# Altium schematic sheet Power.SchDoc
size C; SheetNumber: 4; SheetTotal: 5
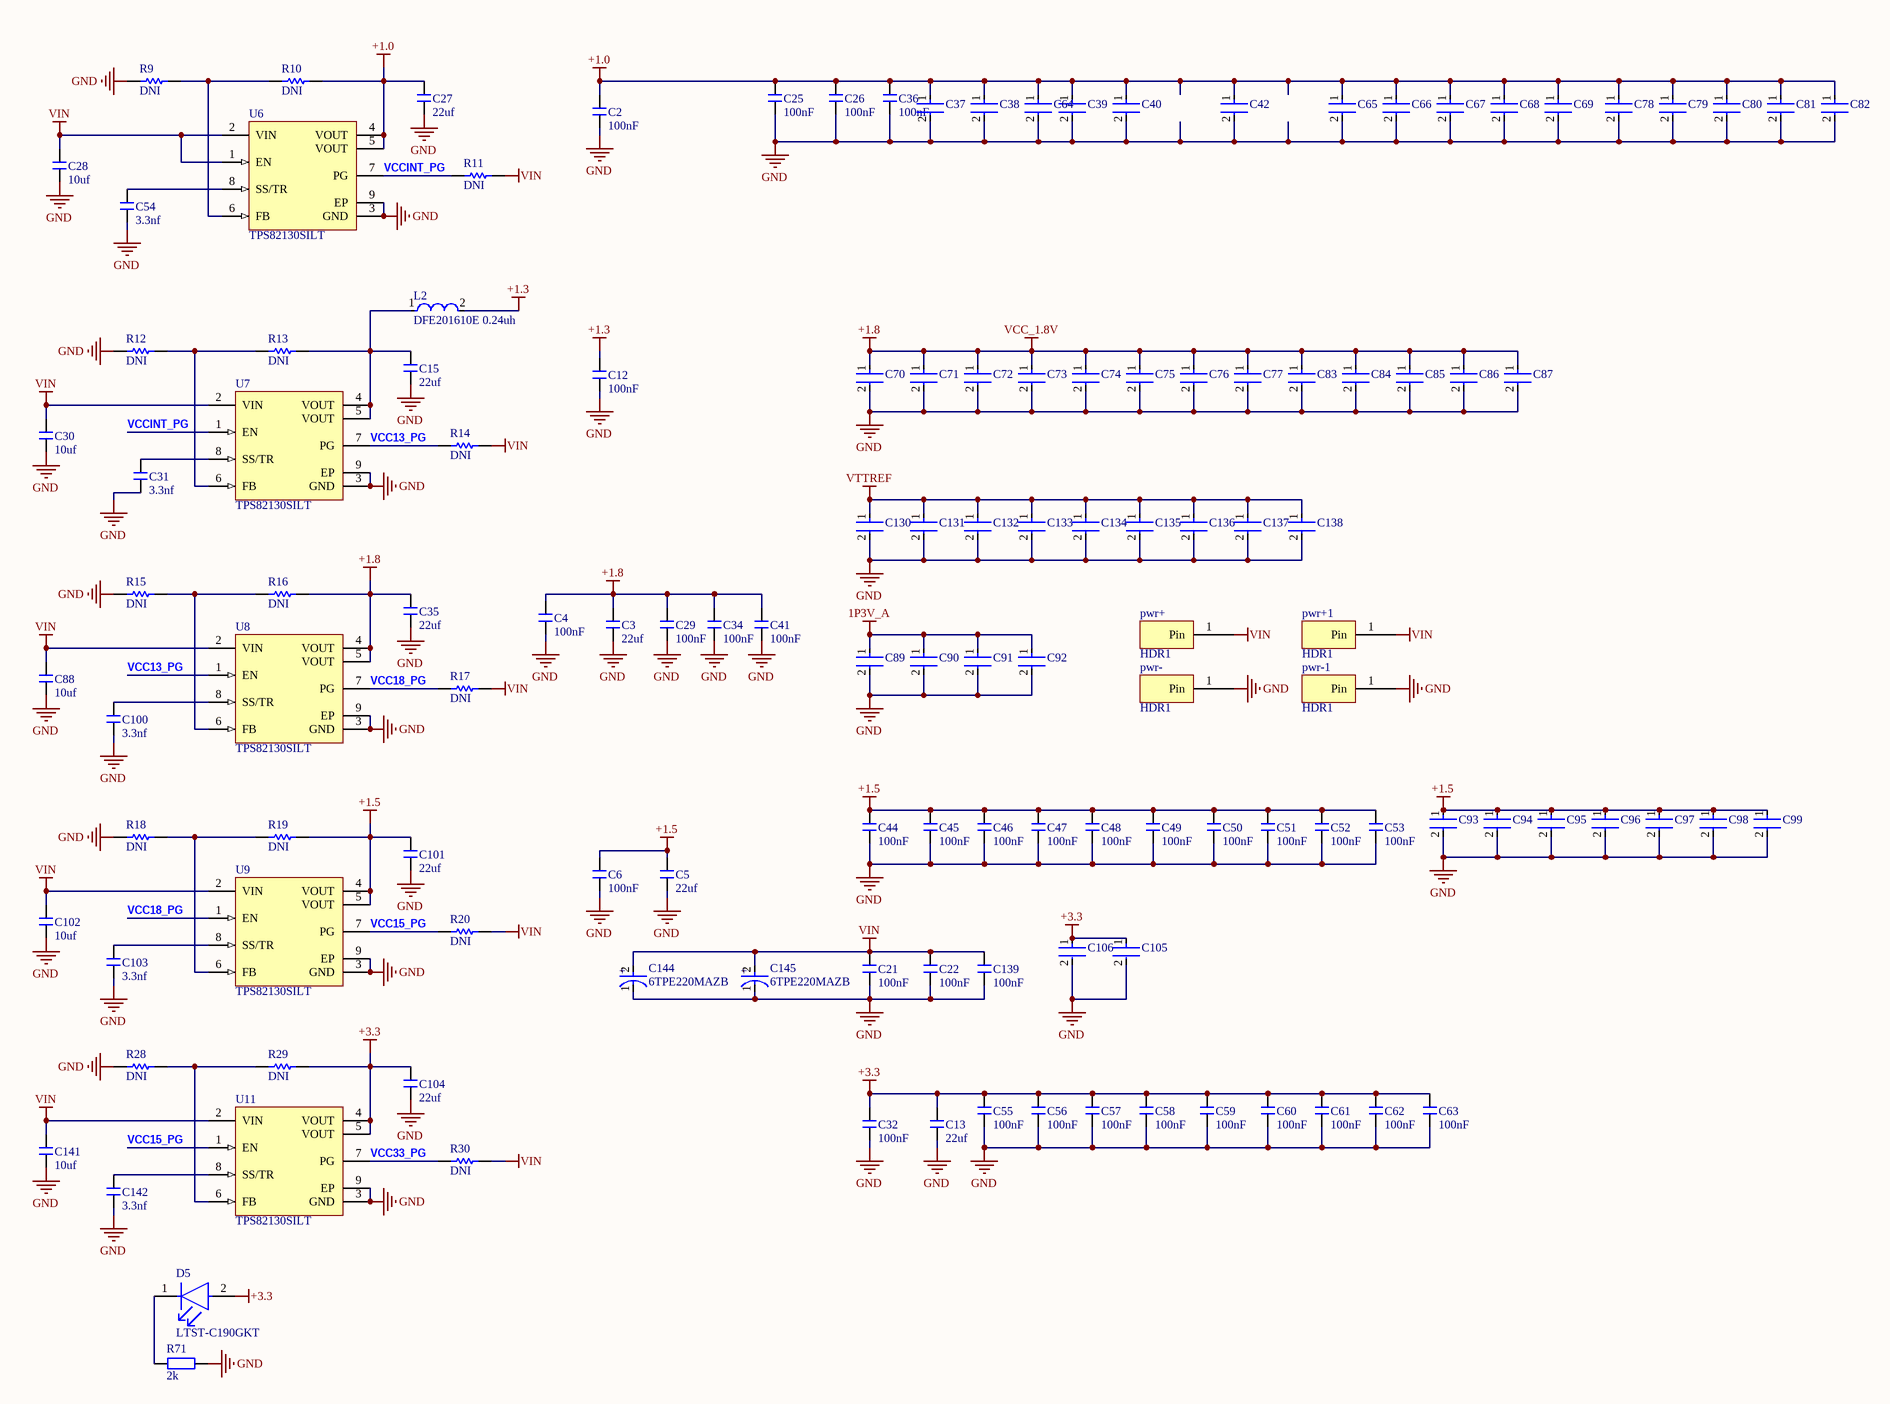
[diagram p0: Power.SchDoc]

## Parts
C2  100nF  [CAP_0402]
C3  22uf  [CAP_0603]
C4  100nF  [CAP_0402]
C5  22uf  [CAP_0603]
C6  100nF  [CAP_0402]
C12  100nF  [CAP_0402]
C13  22uf  [CAP_0603]
C15  22uf  [CAP_0603]
C21  100nF  [CAP_0402]
C22  100nF  [CAP_0402]
C25  100nF  [CAP_0402]
C26  100nF  [CAP_0402]
C27  22uf  [CAP_0603]
C28  10uf  [CAP_0603]
C29  100nF  [CAP_0201]
C30  10uf  [CAP_0603]
C31  3.3nf  [CAP_0402]
C32  100nF  [CAP_0201]
C34  100nF  [CAP_0201]
C35  22uf  [CAP_0603]
C36  100nF  [CAP_0402]
C37  GRM033R61A104KE15D  [FP-GRM033-0_03-IPC_C]  (value not drawn)
C38  GRM033R61A104KE15D  [FP-GRM033-0_03-IPC_C]  (value not drawn)
C39  GRM033R61A104KE15D  [FP-GRM033-0_03-IPC_C]  (value not drawn)
C40  GRM033R61A104KE15D  [FP-GRM033-0_03-IPC_C]  (value not drawn)
C41  100nF  [CAP_0201]
C42  GRM033R61A104KE15D  [FP-GRM033-0_03-IPC_C]  (value not drawn)
C44  100nF  [CAP_0402]
C45  100nF  [CAP_0402]
C46  100nF  [CAP_0402]
C47  100nF  [CAP_0402]
C48  100nF  [CAP_0402]
C49  100nF  [CAP_0402]
C50  100nF  [CAP_0402]
C51  100nF  [CAP_0402]
C52  100nF  [CAP_0402]
C53  100nF  [CAP_0402]
C54  3.3nf  [CAP_0402]
C55  100nF  [CAP_0402]
C56  100nF  [CAP_0402]
C57  100nF  [CAP_0402]
C58  100nF  [CAP_0402]
C59  100nF  [CAP_0201]
C60  100nF  [CAP_0201]
C61  100nF  [CAP_0201]
C62  100nF  [CAP_0402]
C63  100nF  [CAP_0402]
C64  GRM033R61A104KE15D  [FP-GRM033-0_03-IPC_C]  (value not drawn)
C65  GRM033R61A104KE15D  [FP-GRM033-0_03-IPC_C]  (value not drawn)
C66  GRM033R61A104KE15D  [FP-GRM033-0_03-IPC_C]  (value not drawn)
C67  GRM033R61A104KE15D  [FP-GRM033-0_03-IPC_C]  (value not drawn)
C68  GRM033R61A104KE15D  [FP-GRM033-0_03-IPC_C]  (value not drawn)
C69  GRM033R61A104KE15D  [FP-GRM033-0_03-IPC_C]  (value not drawn)
C70  GRM033R61A104KE15D  [FP-GRM033-0_03-IPC_C]  (value not drawn)
C71  GRM033R61A104KE15D  [FP-GRM033-0_03-IPC_C]  (value not drawn)
C72  GRM033R61A104KE15D  [FP-GRM033-0_03-IPC_C]  (value not drawn)
C73  GRM033R61A104KE15D  [FP-GRM033-0_03-IPC_C]  (value not drawn)
C74  GRM033R61A104KE15D  [FP-GRM033-0_03-IPC_C]  (value not drawn)
C75  GRM033R61A104KE15D  [FP-GRM033-0_03-IPC_C]  (value not drawn)
C76  GRM033R61A104KE15D  [FP-GRM033-0_03-IPC_C]  (value not drawn)
C77  GRM033R61A104KE15D  [FP-GRM033-0_03-IPC_C]  (value not drawn)
C78  GRM033R61A104KE15D  [FP-GRM033-0_03-IPC_C]  (value not drawn)
C79  GRM033R61A104KE15D  [FP-GRM033-0_03-IPC_C]  (value not drawn)
C80  GRM033R61A104KE15D  [FP-GRM033-0_03-IPC_C]  (value not drawn)
C81  GRM033R61A104KE15D  [FP-GRM033-0_03-IPC_C]  (value not drawn)
C82  GRM033R61A104KE15D  [FP-GRM033-0_03-IPC_C]  (value not drawn)
C83  GRM033R61A104KE15D  [FP-GRM033-0_03-IPC_C]  (value not drawn)
C84  GRM033R61A104KE15D  [FP-GRM033-0_03-IPC_C]  (value not drawn)
C85  GRM033R61A104KE15D  [FP-GRM033-0_03-IPC_C]  (value not drawn)
C86  GRM033R61A104KE15D  [FP-GRM033-0_03-IPC_C]  (value not drawn)
C87  GRM033R61A104KE15D  [FP-GRM033-0_03-IPC_C]  (value not drawn)
C88  10uf  [CAP_0603]
C89  GRM033R61A104KE15D  [FP-GRM033-0_03-IPC_C]  (value not drawn)
C90  GRM033R61A104KE15D  [FP-GRM033-0_03-IPC_C]  (value not drawn)
C91  GRM033R61A104KE15D  [FP-GRM033-0_03-IPC_C]  (value not drawn)
C92  GRM033R61A104KE15D  [FP-GRM033-0_03-IPC_C]  (value not drawn)
C93  GRM033R61A104KE15D  [FP-GRM033-0_03-IPC_C]  (value not drawn)
C94  GRM033R61A104KE15D  [FP-GRM033-0_03-IPC_C]  (value not drawn)
C95  GRM033R61A104KE15D  [FP-GRM033-0_03-IPC_C]  (value not drawn)
C96  GRM033R61A104KE15D  [FP-GRM033-0_03-IPC_C]  (value not drawn)
C97  GRM033R61A104KE15D  [FP-GRM033-0_03-IPC_C]  (value not drawn)
C98  GRM033R61A104KE15D  [FP-GRM033-0_03-IPC_C]  (value not drawn)
C99  GRM033R61A104KE15D  [FP-GRM033-0_03-IPC_C]  (value not drawn)
C100  3.3nf  [CAP_0402]
C101  22uf  [CAP_0603]
C102  10uf  [CAP_0603]
C103  3.3nf  [CAP_0402]
C104  22uf  [CAP_0603]
C105  GRM033R61A104KE15D  [FP-GRM033-0_03-IPC_C]  (value not drawn)
C106  GRM033R61A104KE15D  [FP-GRM033-0_03-IPC_C]  (value not drawn)
C130  GRM033R61A104KE15D  [FP-GRM033-0_03-IPC_C]  (value not drawn)
C131  GRM033R61A104KE15D  [FP-GRM033-0_03-IPC_C]  (value not drawn)
C132  GRM033R61A104KE15D  [FP-GRM033-0_03-IPC_C]  (value not drawn)
C133  GRM033R61A104KE15D  [FP-GRM033-0_03-IPC_C]  (value not drawn)
C134  GRM033R61A104KE15D  [FP-GRM033-0_03-IPC_C]  (value not drawn)
C135  GRM033R61A104KE15D  [FP-GRM033-0_03-IPC_C]  (value not drawn)
C136  GRM033R61A104KE15D  [FP-GRM033-0_03-IPC_C]  (value not drawn)
C137  GRM033R61A104KE15D  [FP-GRM033-0_03-IPC_C]  (value not drawn)
C138  GRM033R61A104KE15D  [FP-GRM033-0_03-IPC_C]  (value not drawn)
C139  100nF  [CAP_0402]
C141  10uf  [CAP_0603]
C142  3.3nf  [CAP_0402]
C144  6TPE220MAZB  [FP-TPEB2-MFG]
C145  6TPE220MAZB  [FP-TPEB2-MFG]
D5  LTST-C190GKT  [FP-LTST-C190GKT-MFG]
L2  DFE201610E 0.24uh  [FP-DFE201610C-MFG]
pwr+  HDR1  [HDR1]
pwr+1  HDR1  [HDR1]
pwr-  HDR1  [HDR1]
pwr-1  HDR1  [HDR1]
R9  DNI  [RES_0402]
R10  DNI  [RES_0402]
R11  DNI  [RES_0402]
R12  DNI  [RES_0402]
R13  DNI  [RES_0402]
R14  DNI  [RES_0402]
R15  DNI  [RES_0402]
R16  DNI  [RES_0402]
R17  DNI  [RES_0402]
R18  DNI  [RES_0402]
R19  DNI  [RES_0402]
R20  DNI  [RES_0402]
R28  DNI  [RES_0402]
R29  DNI  [RES_0402]
R30  DNI  [RES_0402]
R71  2k  [RES_0402]
U6  TPS82130SILT  [SIL0008D_V]
U7  TPS82130SILT  [SIL0008D_V]
U8  TPS82130SILT  [SIL0008D_V]
U9  TPS82130SILT  [SIL0008D_V]
U11  TPS82130SILT  [SIL0008D_V]

## Nets
1P3V_A: C89.1 C90.1 C91.1 C92.1
+1.0: C2.1 C25.1 C26.1 C27.2 C36.1 C37.1 C38.1 C39.1 C40.1 C42.1 C64.1 C65.1 C66.1 C67.1 C68.1 C69.1 C78.1 C79.1 C80.1 C81.1 C82.1 R10.1 U6.4(VOUT) U6.5(VOUT)
+1.3: C12.1 L2.2
+1.5: C5.2 C6.1 C44.1 C45.1 C46.1 C47.1 C48.1 C49.1 C50.1 C51.1 C52.1 C53.1 C93.1 C94.1 C95.1 C96.1 C97.1 C98.1 C99.1 C101.2 R19.1 U9.4(VOUT) U9.5(VOUT)
+1.8: C3.2 C4.1 C29.1 C34.1 C35.2 C41.1 C70.1 C71.1 C72.1 C73.1 C74.1 C75.1 C76.1 C77.1 C83.1 C84.1 C85.1 C86.1 C87.1 R16.1 U8.4(VOUT) U8.5(VOUT)  [also labelled VCC_1.8V]
+3.3: C13.2 C32.1 C55.1 C56.1 C57.1 C58.1 C59.1 C60.1 C61.1 C62.1 C63.1 C104.2 C105.1 C106.1 D5.2(A) R29.1 U11.4(VOUT) U11.5(VOUT)
GND: C2.2 C3.1 C4.2 C5.1 C6.2 C12.2 C13.1 C15.1 C21.2 C22.2 C25.2 C26.2 C27.1 C28.1 C29.2 C30.1 C31.1 C32.2 C34.2 C35.1 C36.2 C37.2 C38.2 C39.2 C40.2 C41.2 C42.2 C44.2 C45.2 C46.2 C47.2 C48.2 C49.2 C50.2 C51.2 C52.2 C53.2 C54.1 C55.2 C56.2 C57.2 C58.2 C59.2 C60.2 C61.2 C62.2 C63.2 C64.2 C65.2 C66.2 C67.2 C68.2 C69.2 C70.2 C71.2 C72.2 C73.2 C74.2 C75.2 C76.2 C77.2 C78.2 C79.2 C80.2 C81.2 C82.2 C83.2 C84.2 C85.2 C86.2 C87.2 C88.1 C89.2 C90.2 C91.2 C92.2 C93.2 C94.2 C95.2 C96.2 C97.2 C98.2 C99.2 C100.1 C101.1 C102.1 C103.1 C104.1 C105.2 C106.2 C130.2 C131.2 C132.2 C133.2 C134.2 C135.2 C136.2 C137.2 C138.2 C139.2 C141.1 C142.1 C144.1(C) C145.1(C) pwr-.1(Pin) pwr-1.1(Pin) R9.2 R12.2 R15.2 R18.2 R28.2 R71.1 U6.3(GND) U6.9(EP) U7.3(GND) U7.9(EP) U8.3(GND) U8.9(EP) U9.3(GND) U9.9(EP) U11.3(GND) U11.9(EP)
VIN: C21.1 C22.1 C28.2 C30.2 C88.2 C102.2 C139.1 C141.2 C144.2(A) C145.2(A) pwr+.1(Pin) pwr+1.1(Pin) R11.1 R14.1 R17.1 R20.1 R30.1 U6.1(EN) U6.2(VIN) U7.2(VIN) U8.2(VIN) U9.2(VIN) U11.2(VIN)
VTTREF: C130.1 C131.1 C132.1 C133.1 C134.1 C135.1 C136.1 C137.1 C138.1
VCC13_PG: R14.2 U7.7(PG) U8.1(EN)
VCC15_PG: R20.2 U9.7(PG) U11.1(EN)
VCC18_PG: R17.2 U8.7(PG) U9.1(EN)
VCC33_PG: R30.2 U11.7(PG)
VCCINT_PG: R11.2 U6.7(PG) U7.1(EN)
NetC15_2: C15.2 L2.1 R13.1 U7.4(VOUT) U7.5(VOUT)
NetC31_2: C31.2 U7.8(SS/TR)
NetC54_2: C54.2 U6.8(SS/TR)
NetC100_2: C100.2 U8.8(SS/TR)
NetC103_2: C103.2 U9.8(SS/TR)
NetC142_2: C142.2 U11.8(SS/TR)
NetD5_1: D5.1(C) R71.2
NetR9_1: R9.1 R10.2 U6.6(FB)
NetR12_1: R12.1 R13.2 U7.6(FB)
NetR15_1: R15.1 R16.2 U8.6(FB)
NetR18_1: R18.1 R19.2 U9.6(FB)
NetR28_1: R28.1 R29.2 U11.6(FB)

## Notes on the sheet
- (in symbol CMP-05429-000001-1) +

## Library data of the parts
C2-C6 C12 C13 C15 C21 C22 C25-C32 C34-C36 C41 C44-C63 C88 C100-C104 C139 C141 C142 = C: 无极性贴片电容; 版权归属: 源创客; BOM名称: 无极性贴片电容; 学习资源: www.ooocke.com
C37-C40 C42 C64-C87 C89-C99 C105 C106 C130-C138 = CMP-2010-01264-2: Chip Multilayer Ceramic Capacitors for General Purpose, 0201, 0.10uF, X5R, 15%, 10%, 10V; Capacitance: 100nF; Mount: Surface Mount; Dielectric: X5R; Width: 0.012inch; Tolerance: 10%; Radiation Hardening: No; Voltage Rating: 10V; REACH SVHC: No SVHC; Height: 0.3mm; Max Operating Temperature: 85°C; Voltage Rating (DC): 10V; Thickness: 0.013inch; Termination: SMD/SMT; Lead Free: Lead Free; Package Quantity: 1; Case/Package: 0201; Min Operating Temperature: -55°C; Weight: 6E-06oz; Length: 0.6mm; Case Code (Imperial): 0201; Depth: 0.3mm; Voltage: 10V; Packaging: Tape and Reel; Case Code (Metric): 0603
C144 C145 = CMP-05429-000001-1: CAP TANT POLY 220UF 6.3V 1411; Leakage Current: 138.6uA; Polarity: Polar; Ripple Current: 1.4A; ESR (Equivalent Series Resistance): 35mR; Tolerance: 20%; Dissipation Factor: 10%; Number of Pins: 2; REACH SVHC: No SVHC; Case Code (Imperial): 1411; Min Operating Temperature: -55°C; Voltage Rating: 6.3V; Radiation Hardening: No; Lead Free: Lead Free; Case Code (Metric): 3528; Length: 3.5mm; Depth: 2.8mm; Case/Package: Molded; Width: 0.11inch; Voltage Rating (DC): 6.3V; Features: General Purpose; Max Operating Temperature: 105°C; Capacitance: 220uF; Height - Seated (Max): 0.079inch; Voltage: 6.3V; Termination: SMD/SMT; Height: 1.9mm; Package Quantity: 2000; Mount: Surface Mount; Packaging: Tape and Reel
D5 = CMP-22017-000005-2: LED GREEN CLEAR CHIP SMD; Dominant Wavelength: 569nm; Reverse Voltage: 5V; Lens Color: Colorless; Viewing Angle: 130°; Voltage: 2V; Forward Current: 30mA; Power Dissipation: 100mW; Luminous Intensity: 6mcd; Number of LEDs: 1; Forward Voltage: 2.1V; Wavelength: 565nm; Test Current: 10mA; Min Operating Temperature: -55°C; Lens Style: Clear; Mount: Surface Mount; Width: 0.8mm; Packaging: Tape and Reel; Lens Transparency: Clear; Case Code (Metric): 1608; Depth: 0.8mm; Case Code (Imperial): 0603; Case/Package: 0603; Number of Pins: 2; Max Operating Temperature: 85°C; Lead Free: Lead Free; Number of Elements: 1; Length: 1.6mm; Height: 0.8mm; Package Quantity: 1; Power Rating: 100mW; Radiation Hardening: No; Illumination Color: Green; Color: Green
L2 = CMP-06042-015199-1: 0.24uh
R9-R20 R28-R30 = RES
R71 = R: 贴片电阻; 版权归属: 源创客; BOM名称: 贴片电阻; 学习资源: www.ooocke.com
U6-U9 U11 = CMP-2000-07569-1: Step-Down Converter MicroSiP(TM) Module with Integrated Inductor, 3 A, 3 to 17 V, -40 to 125 degC, 8-Pin uSiP (SIL), Tape and Reel; Manufacturer: Texas Instruments; Quiescent Current: 20uA; Output Voltage: 5V; Output Current: 3A; Max Input Voltage: 17V; Switching Frequency: 2MHz; Min Output Voltage: 900mV; Number of Outputs: 1; Min Input Voltage: 3V; Datasheet URL: http://www.ti.com/lit/ds/symlink/tps82130.pdf; Packaging: CutTape; Datasheet Version: Rev. C, 01/2017; Package Reference: SIL0008D; Case/Package: SMD/SMT; Manufacturer URL: http://www.ti.com/; Length: 0.12inch; Lead Free: LeadFree; Mount: SurfaceMount; Number of Pins: 8; Package Description: 8-Pin Single In-line Package, Body 3 x 2.8 mm, Pitch 0.65 mm; Max Output Voltage: 5V; Mounting Technology: SurfaceMount; Height: 0.06inch; Max Operating Temperature: 125degC; Width: 0.11inch; Min Operating Temperature: -40degC; Voltage - Output 1: 5V; RoHSCompliant: True; REACH SVHC: NoSVHC; Max Output Current: 3A